# Altium schematic sheet PhaseShiftNetwork.SchDoc: Phase Shifter
size 594 x 420 mm; SheetNumber: 4; SheetTotal: 7
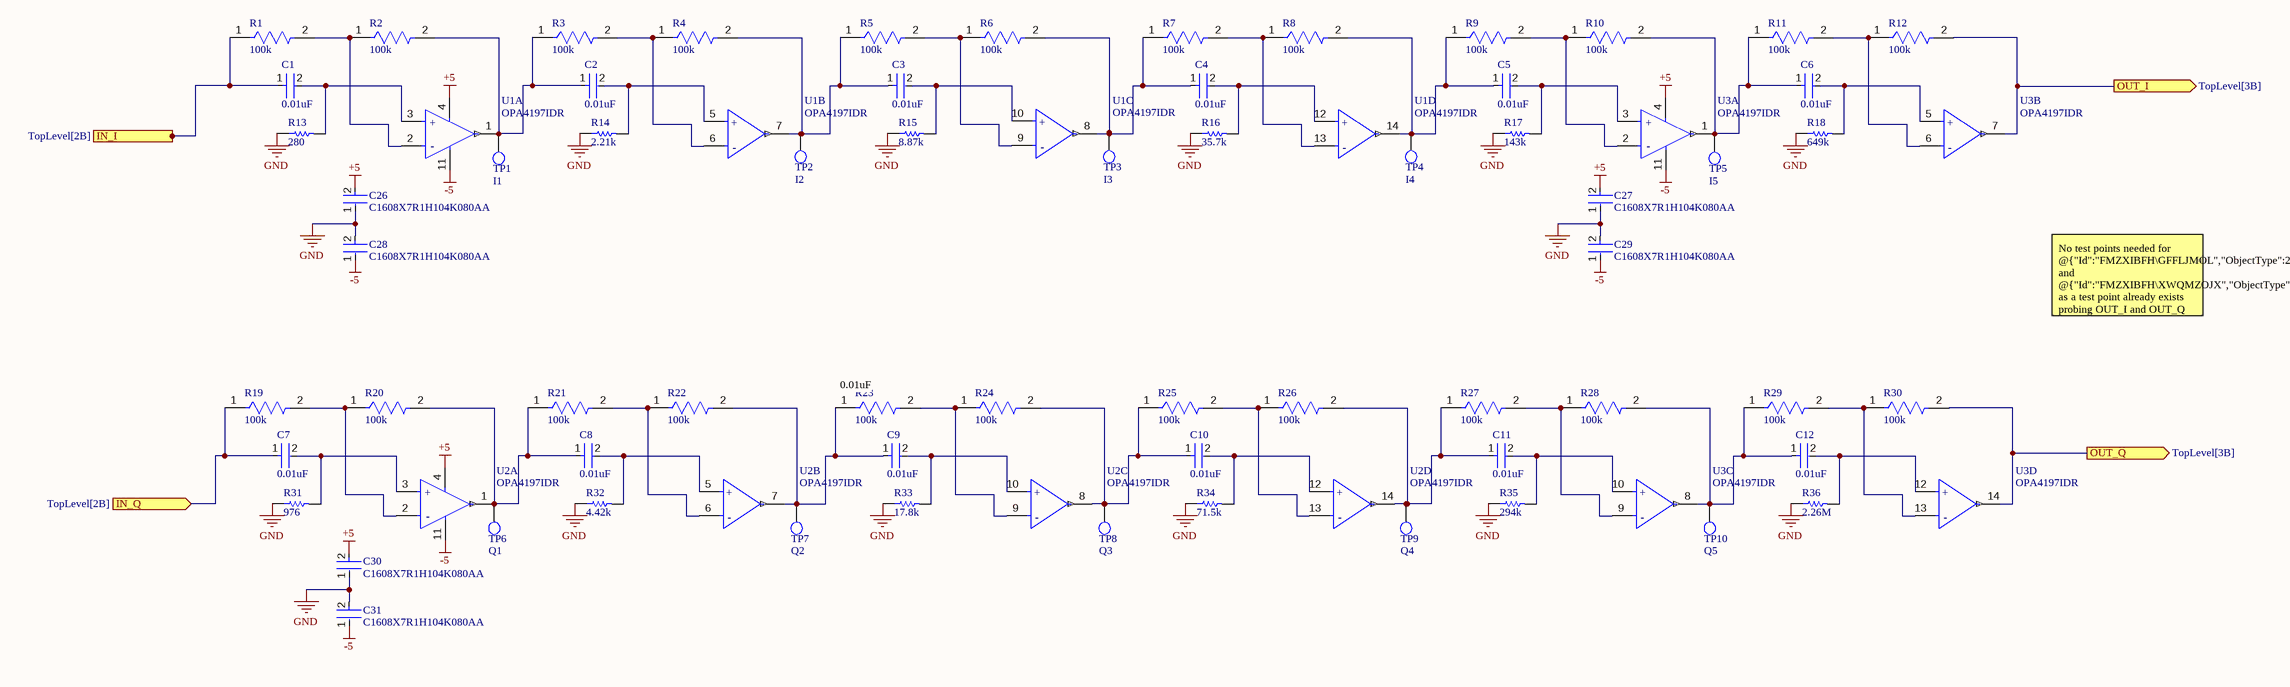
[diagram p0: PhaseShiftNetwork.SchDoc]

## Parts
C1  0.01uF  [FP-C0603C-CF-MFG]
C2  0.01uF  [FP-C0603C-CF-MFG]
C3  0.01uF  [FP-C0603C-CF-MFG]
C4  0.01uF  [FP-C0603C-CF-MFG]
C5  0.01uF  [FP-C0603C-CF-MFG]
C6  0.01uF  [FP-C0603C-CF-MFG]
C7  0.01uF  [FP-C0603C-CF-MFG]
C8  0.01uF  [FP-C0603C-CF-MFG]
C9  0.01uF  [FP-C0603C-CF-MFG]
C10  0.01uF  [FP-C0603C-CF-MFG]
C11  0.01uF  [FP-C0603C-CF-MFG]
C12  0.01uF  [FP-C0603C-CF-MFG]
C26  C1608X7R1H104K080AA  [FP-C1608-080-0_1-MFG]
C27  C1608X7R1H104K080AA  [FP-C1608-080-0_1-MFG]
C28  C1608X7R1H104K080AA  [FP-C1608-080-0_1-MFG]
C29  C1608X7R1H104K080AA  [FP-C1608-080-0_1-MFG]
C30  C1608X7R1H104K080AA  [FP-C1608-080-0_1-MFG]
C31  C1608X7R1H104K080AA  [FP-C1608-080-0_1-MFG]
R1  100k  [FP-RC0805-0_6-IPC_C]
R2  100k  [FP-RC0805-0_6-IPC_C]
R3  100k  [FP-RC0805-0_6-IPC_C]
R4  100k  [FP-RC0805-0_6-IPC_C]
R5  100k  [FP-RC0805-0_6-IPC_C]
R6  100k  [FP-RC0805-0_6-IPC_C]
R7  100k  [FP-RC0805-0_6-IPC_C]
R8  100k  [FP-RC0805-0_6-IPC_C]
R9  100k  [FP-RC0805-0_6-IPC_C]
R10  100k  [FP-RC0805-0_6-IPC_C]
R11  100k  [FP-RC0805-0_6-IPC_C]
R12  100k  [FP-RC0805-0_6-IPC_C]
R13  280  [RESC2013X60X35ML10T20]
R14  2.21k  [RESC2013X60X35ML10T20]
R15  8.87k  [RESC2013X60X35ML10T20]
R16  35.7k  [RESC2013X60X35ML10T20]
R17  143k  [RESC2013X60X35ML10T20]
R18  649k  [RESC2013X60X35ML10T20]
R19  100k  [FP-RC0805-0_6-IPC_C]
R20  100k  [FP-RC0805-0_6-IPC_C]
R21  100k  [FP-RC0805-0_6-IPC_C]
R22  100k  [FP-RC0805-0_6-IPC_C]
R23  100k  [FP-RC0805-0_6-IPC_C]
R24  100k  [FP-RC0805-0_6-IPC_C]
R25  100k  [FP-RC0805-0_6-IPC_C]
R26  100k  [FP-RC0805-0_6-IPC_C]
R27  100k  [FP-RC0805-0_6-IPC_C]
R28  100k  [FP-RC0805-0_6-IPC_C]
R29  100k  [FP-RC0805-0_6-IPC_C]
R30  100k  [FP-RC0805-0_6-IPC_C]
R31  976  [RESC2013X60X35ML10T20]
R32  4.42k  [RESC2013X60X35ML10T20]
R33  17.8k  [RESC2013X60X35ML10T20]
R34  71.5k  [RESC2013X60X35ML10T20]
R35  294k  [RESC2013X60X35ML10T20]
R36  2.26M  [RESC2013X60X35ML10T20]
TP1  I1  [TP-PAD]
TP2  I2  [TP-PAD]
TP3  I3  [TP-PAD]
TP4  I4  [TP-PAD]
TP5  I5  [TP-PAD]
TP6  Q1  [TP-PAD]
TP7  Q2  [TP-PAD]
TP8  Q3  [TP-PAD]
TP9  Q4  [TP-PAD]
TP10  Q5  [TP-PAD]
U1  OPA4197IDR  [FP-D0014A-MFG]  (parts A,B,C,D of 4)
U2  OPA4197IDR  [FP-D0014A-MFG]  (parts A,B,C,D of 4)
U3  OPA4197IDR  [FP-D0014A-MFG]  (parts A,B,C,D of 4)

## Ports
IN_I (in, see TopLevel[2B]), IN_Q (in, see TopLevel[2B]), OUT_I (out, see TopLevel[3B]), OUT_Q (out, see TopLevel[3B])

## Nets
+5: C26.2 C27.2 C30.2 U1.4(V+) U2.4(V+) U3.4(V+)
-5: C28.1 C29.1 C31.1 U1.11(V-) U2.11(V-) U3.11(V-)
GND: C26.1 C27.1 C28.2 C29.2 C30.1 C31.2 R13.1 R14.1 R15.1 R16.1 R17.1 R18.1 R31.1 R32.1 R33.1 R34.1 R35.1 R36.1
IN_I: C1.1 R1.1 ; port IN_I
IN_Q: C7.1 R19.1 ; port IN_Q
OUT_I: R12.2 U3.7(OUT_B) ; port OUT_I
OUT_Q: R30.2 U3.14(OUT_D) ; port OUT_Q
NetC1_2: C1.2 R13.2 U1.3(+IN_A)
NetC2_1: C2.1 R2.2 R3.1 TP1.1 U1.1(OUT_A)
NetC2_2: C2.2 R14.2 U1.5(+IN_B)
NetC3_1: C3.1 R4.2 R5.1 TP2.1 U1.7(OUT_B)
NetC3_2: C3.2 R15.2 U1.10(+IN_C)
NetC4_1: C4.1 R6.2 R7.1 TP3.1 U1.8(OUT_C)
NetC4_2: C4.2 R16.2 U1.12(+IN_D)
NetC5_1: C5.1 R8.2 R9.1 TP4.1 U1.14(OUT_D)
NetC5_2: C5.2 R17.2 U3.3(+IN_A)
NetC6_1: C6.1 R10.2 R11.1 TP5.1 U3.1(OUT_A)
NetC6_2: C6.2 R18.2 U3.5(+IN_B)
NetC7_2: C7.2 R31.2 U2.3(+IN_A)
NetC8_1: C8.1 R20.2 R21.1 TP6.1 U2.1(OUT_A)
NetC8_2: C8.2 R32.2 U2.5(+IN_B)
NetC9_1: C9.1 R22.2 R23.1 TP7.1 U2.7(OUT_B)
NetC9_2: C9.2 R33.2 U2.10(+IN_C)
NetC10_1: C10.1 R24.2 R25.1 TP8.1 U2.8(OUT_C)
NetC10_2: C10.2 R34.2 U2.12(+IN_D)
NetC11_1: C11.1 R26.2 R27.1 TP9.1 U2.14(OUT_D)
NetC11_2: C11.2 R35.2 U3.10(+IN_C)
NetC12_1: C12.1 R28.2 R29.1 TP10.1 U3.8(OUT_C)
NetC12_2: C12.2 R36.2 U3.12(+IN_D)
NetR1_2: R1.2 R2.1 U1.2(-IN_A)
NetR3_2: R3.2 R4.1 U1.6(-IN_B)
NetR5_2: R5.2 R6.1 U1.9(-IN_C)
NetR7_2: R7.2 R8.1 U1.13(-IN_D)
NetR9_2: R9.2 R10.1 U3.2(-IN_A)
NetR11_2: R11.2 R12.1 U3.6(-IN_B)
NetR19_2: R19.2 R20.1 U2.2(-IN_A)
NetR21_2: R21.2 R22.1 U2.6(-IN_B)
NetR23_2: R23.2 R24.1 U2.9(-IN_C)
NetR25_2: R25.2 R26.1 U2.13(-IN_D)
NetR27_2: R27.2 R28.1 U3.9(-IN_C)
NetR29_2: R29.2 R30.1 U3.13(-IN_D)

## Notes on the sheet
- No test points needed for @{"Id":"FMZXIBFH\GFFLJMOL","ObjectType":2} and @{"Id":"FMZXIBFH\XWQMZOJX","ObjectType":2} as a test point already exists probing OUT_I and OUT_Q on the top level.
- (near R23) 0.01uF
- DWG NO:
- REV:
- THIS DOCUMENT AND THE DATA DISCLOSED HEREIN OR
- HEREWITH IS THE PROPERTY OF ALTIUM LIMITED AND MAY
- BE FREELY DISTRIBUTED IN WHOLE. NO RIGHTS ARE
- RESERVED OR EXPRESS OR IMPLIED WARANTEE GIVEN.
- REVISION
- DESCRIPTION
- DATE
- APPROVED
- ENG:
- APPROVALS
- PROJECT
- DSN:
- CHK:
- REFERENCE DOCUMENTS
- PROJECT REVISION:
- TITLE
- DOCUMENT REVISION:
- DESIGN ITEM:
- BOM:
- FAB DWG:
- PCB DWG:
- ASSY DWG:
- SCALE:
- A2
- SIZE
- CAGE CODE
- FILE NAME
- DWG NO.
- SHEET
- OF
- REV
- (in symbol CMP-04895-000272-1, part A) +; -
- (in symbol CMP-04895-000272-1, part B) +; -
- (in symbol CMP-04895-000272-1, part C) +; -
- (in symbol CMP-04895-000272-1, part D) +; -

## Library data of the parts
C1-C12 = CMP-2006-03370-2: CAP CER 10000PF 25V 1% NP0 0603; Manufacturer: KEMET; Manufacturer Part Number: C0603C103F3GACTU; Automotive Grade: Grade 1; Capacitance: 10,000 pF; Temperature Coefficient: 30ppm/°C; Material: Ceramic; Value: 10,000 pF; Temperature Characteristic: C0G; Tolerance: 0.01; Temperature Range High: +125°C; Category: Cap; Mouser Description: Multilayer Ceramic Capacitors MLCC - SMD/SMT 25volts 10000pF 1% C0G; Automotive: Yes; Octopart: https://octopart.com/c0603c103f3gactu-kemet-12577573; ComponentLink2Description: Datasheet; Temperature Range Low: -55°C; Package: C0603C-CF; RoHS: TRUE; Temperature: -55°C to +125°C; Device Class L1: Passive Components; ComponentLink2URL: https://api.kemet.com/component-edge/download/datasheet/C0603C100J5GACAUTO.pdf; Voltage Rating: 25 V; Digikey Description: CAP CER 10000PF 25V 1% NP0 0603; Device Class L2: Capacitors; Device Class L3: Ceramic Capacitors; Height: 0.87mm; Lead Free: Yes
C26-C31 = CMP-2000-04982-2: Multilayer Ceramic Capacitors 100nF ±10% 50V X7R SMD 0603; REACH SVHC: No SVHC; Voltage: 50V; Min Operating Temperature: -55°C; Package Quantity: 1; Case Code (Metric): 1608; Series: C; Termination: SMD/SMT; Length: 1.6mm; Voltage Rating: 50V; Case Code (Imperial): 0603; Number of Pins: 2; RoHS Compliant: Yes; Thickness: 0.037inch; Resistor Type: Ceramic; Radiation Hardening: No; Weight: 7.1E-05oz; Mount: Surface Mount; Capacitance: 100nF; Voltage Rating (DC): 50V; Construction: Flat; Tolerance: 10%; Lead Free: Lead Free; Case/Package: 0603; Max Operating Temperature: 125°C; Height: 0.8mm; Depth: 0.8mm; Packaging: Tape and Reel; Width: 0.031inch; Dielectric Material: Ceramic; Dielectric: X7R
R1-R12 R19-R30 = CMP-2100-03668-5: RES 100K OHM 1% 1/8W 0805; Power Rating: 125mW; Temperature Coefficient: 100ppm/°C; Voltage Rating (DC): 150V; Resistance: 100kR; Package Quantity: 1; Case/Package: 0805; Lead Pitch: 0.4mm; Case Code (Imperial): 0805; Construction: Rectangular; Number of Terminations: 2; RoHS Compliant: Yes; Max Power Dissipation: 125mW; Tolerance: 1%; Max Operating Temperature: 155°C; Resistance Tolerance: 1%; Lead Free: Lead Free; Packaging: Tape and Reel; Resistor Type: Thick Film; Min Operating Temperature: -55°C; Case Code (Metric): 2012; Series: RC; Technology: THICK FILM; Voltage Rating: 150V; Termination: SMD/SMT; Width: 0.049inch; Number of Pins: 2; Features: Moisture Resistant; Military Standard: Not; Length: 0.079inch; Depth: 1.25mm; Size Code: 0805; Height: 0.024inch
R13 R15-R18 R31-R36 = CMP-2001-01038-1: Manufacturer: Yageo; Part Number: RC0805FR-07280RL
R14 = CMP-2001-01038-1: Manufacturer: Yageo; Part Number: RC0805FR-072K21L
TP1-TP10 = TP-PAD
U1-U3 = CMP-04895-000272-1: IC OPAMP GP 4 CIRCUIT 14SOIC; Number of Channels: 4; Gain Bandwidth Product: 10MHz; Max Operating Temperature: 125°C; Min Operating Temperature: -40°C; Lead Free: Lead Free; RoHS Compliant: Yes; Case/Package: SOIC